# Altium schematic sheet PowerSupply.SchDoc
size A4
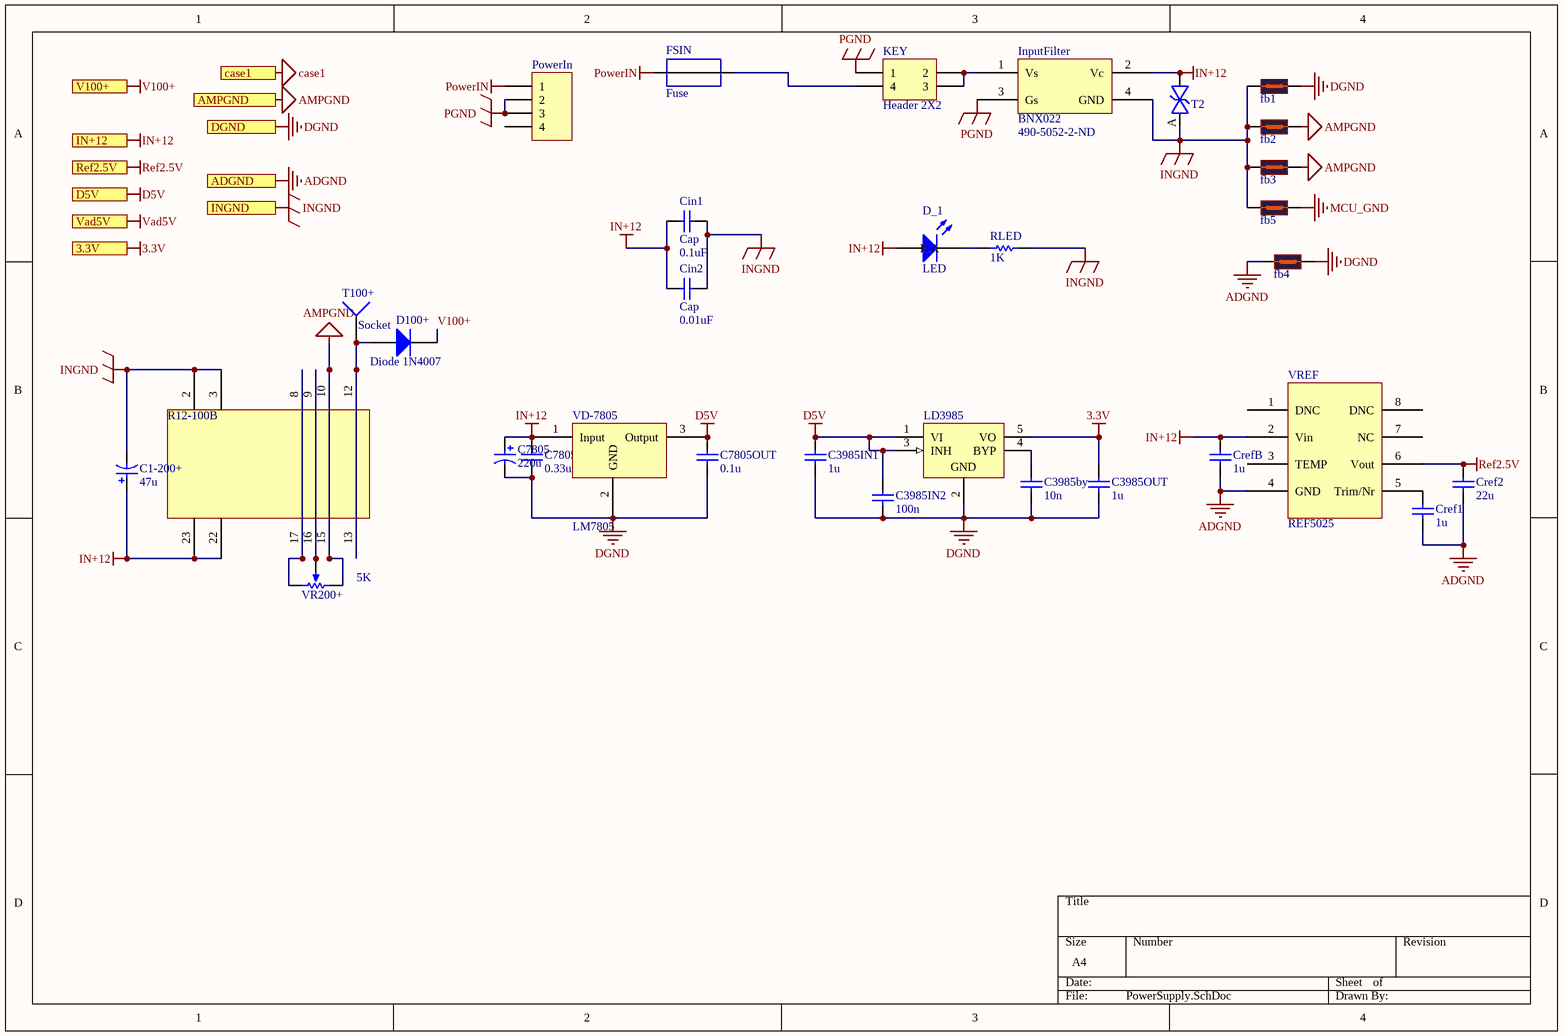
[diagram p0: PowerSupply.SchDoc]

## Parts
C1-200+  value 47u  [Cap_Rad2.5]  (hidden comment: ?)
C3985by  10n  [0805]
C3985IN1  1u  [0805]
C3985IN2  100n  [0805]
C3985OUT  1u  [0805]
C7805  value 220u  [Cap_Rad4mm]  (hidden comment: ?)
C7805IN  0.33u  [0805]
C7805OUT  0.1u  [0805]
Cin1  Cap  value 0.1uF  [0805]
Cin2  Cap  value 0.01uF  [0805]
Cref1  1u  [0805]
Cref2  22u  [0805]
CrefB  1u  [0805]
D100+  Diode 1N4007  [SMB]
D_1  LED  [LIGHT]
fb1  MH2029-300YCT-ND  [FB_0805]  (value not drawn)
fb2  MH2029-300YCT-ND  [FB_0805]  (value not drawn)
fb3  MH2029-300YCT-ND  [FB_0805]  (value not drawn)
fb4  MH2029-300YCT-ND  [FB_0805]  (value not drawn)
fb5  MH2029-300YCT-ND  [FB_0805]  (value not drawn)
FSIN  Fuse  [FuseHolder]
InputFilter  BNX022  Supplier Part Number 1: 490-5052-2-ND  [BNX022]
KEY  Header 2X2  [Power4Pin]
LD3985  LD3985G33R  [TSOT23-5L_N]  (value not drawn)
PowerIn  Header 4  [AC/DC3]  (value not drawn)
R12-100B  R12-150B  [R12-150B]  (value not drawn)
RLED  value 1K  [0805]  (hidden comment: ?)
T2  SMAJ150CA-E3/61GICT-ND  [DO-214AC]  (value not drawn)
T100+  Socket  [hole]
VD-7805  LM7805  [7805]
VR200+  value 5K  [VR]  (hidden comment: RPot)
VREF  REF5025  [SO8]

## Ports
3.3V, ADGND, AMPGND, case1, D5V, DGND, IN+12, INGND, Ref2.5V, V100+, Vad5V

## Nets
3.3V: C3985OUT.2 LD3985.5(VO) ; port 3.3V
ADGND: Cref1.1 Cref2.1 CrefB.1 fb4.1 VREF.4(GND) ; port ADGND
AMPGND: fb2.2 fb3.2 R12-100B.10 R12-100B.15 VR200+.1(TOP) ; port AMPGND
case1: port case1
D5V: C3985IN1.2 C3985IN2.2 C7805OUT.2 LD3985.1(VI) LD3985.3(INH) VD-7805.3(Output) ; port D5V
DGND: C3985by.1 C3985IN1.1 C3985IN2.1 C3985OUT.1 C7805.2(-) C7805IN.1 C7805OUT.1 fb1.2 fb4.2 LD3985.2(GND) VD-7805.2(GND) ; port DGND
IN+12: C1-200+.1(+) C7805.1(+) C7805IN.2 Cin1.1 Cin2.1 CrefB.2 D_1.A InputFilter.2(Vc) R12-100B.22 R12-100B.23 T2.K VD-7805.1(Input) VREF.2(Vin) ; port IN+12
INGND: C1-200+.2(-) Cin1.2 Cin2.2 fb1.1 fb2.1 fb3.1 fb5.1 InputFilter.4(GND) R12-100B.2 R12-100B.3 RLED.2 T2.A ; port INGND
MCU_GND: fb5.2
PGND: InputFilter.3(Gs) KEY.1 PowerIn.2 PowerIn.3
PowerIN: FSIN.1 PowerIn.1
Ref2.5V: Cref2.2 VREF.6(Vout) ; port Ref2.5V
V100+: D100+.2(K) ; port V100+
Vad5V: port Vad5V
NetC3985by_2: C3985by.2 LD3985.4(BYP)
NetCref1_2: Cref1.2 VREF.5(Trim/Nr)
NetD100+_1: D100+.1(A) R12-100B.12 R12-100B.13 T100+.1
NetD_1_K: D_1.K RLED.1
NetFSIN_2: FSIN.2 KEY.4
NetInputFilter_1: InputFilter.1(Vs) KEY.2 KEY.3
NetR12-100B_8: R12-100B.8 R12-100B.17 VR200+.2(BOT)
NetR12-100B_9: R12-100B.9 R12-100B.16 VR200+.3(TAP)

Not connected (* = marked no-connect by the designer): PowerIn 4; VREF 1(DNC) 3(TEMP) 7(NC) 8(DNC)

## Library data of the parts
C1-200+ C7805 = Cpol: Capacitor (Semiconductor SIM Model); PartNO: ?
C3985by C3985IN1 C3985IN2 C3985OUT C7805IN = Cap: Capacitor; Value: 0.33uF; Published: 8-Jun-2000; LatestRevisionDate: 17-Jul-2002; LatestRevisionNote: Re-released for DXP Platform.; PackageReference: RAD-0.3; Publisher: Altium Limited
C7805OUT = Cap: Capacitor; Value: 0.1uF; Published: 8-Jun-2000; LatestRevisionDate: 17-Jul-2002; LatestRevisionNote: Re-released for DXP Platform.; PackageReference: RAD-0.3; Publisher: Altium Limited
Cin1 Cin2 = Cap: Capacitor; Published: 8-Jun-2000; LatestRevisionDate: 17-Jul-2002; LatestRevisionNote: Re-released for DXP Platform.; PackageReference: RAD-0.3; Publisher: Altium Limited
Cref1 CrefB = Cap: Capacitor; Value: 1uF; Published: 8-Jun-2000; LatestRevisionDate: 17-Jul-2002; LatestRevisionNote: Re-released for DXP Platform.; PackageReference: RAD-0.3; Publisher: Altium Limited
Cref2 = Cap: Capacitor; Value: 22uF; Published: 8-Jun-2000; LatestRevisionDate: 17-Jul-2002; LatestRevisionNote: Re-released for DXP Platform.; PackageReference: RAD-0.3; Publisher: Altium Limited
D100+ = Diode 1N4007: 1 Amp General Purpose Rectifier; Published: 8-Jun-2000; LatestRevisionDate: 17-Jul-2002; LatestRevisionNote: Re-released for DXP Platform.; DatasheetVersion: 1998; PackageVersion: Aug-1999; PackageReference: DO-41; Publisher: Altium Limited; PackageDescription: Diode, Axial; Body 5.2 x 2.7 mm (LxDia. max), Lead Dia. 0.86 mm (max); Code_JEDEC: DO-204-AL; ComponentLink1Description: Manufacturer Link; ComponentLink1URL: http://www.fairchildsemi.com/; ComponentLink2Description: Datasheet; ComponentLink2URL: http://www.fairchildsemi.com/ds/1N%2F1N4001.pdf
D_1 = LED0: Typical INFRARED GaAs LED; Published: 8-Jun-2000; LatestRevisionDate: 08-Jul-2005; LatestRevisionNote: Mech Layer 1 removed.; PackageReference: LED-0; Publisher: Altium Limited
fb1-fb5 = FerriteBead: Ferrite bead; Value: 30; PartNO: MH2029-300YCT-ND
KEY = Header 2X2: Header, 2-Pin, Dual row; LatestRevisionDate: 17-Jul-2002; LatestRevisionNote: Re-released for DXP Platform.; Publisher: Altium Limited
LD3985 = LD3985G33R: 150mA, Ultra-Low Drop Low Noise BiCMOS Voltage Regulators Low ESR Capacitors Compatible, 3.3V, 5-Pin TSOT23-5L; DatasheetVersion: Jan-2011; PackageVersion: 2011; PackageReference: TSOT23-5L; PackageDescription: 5-Pin SOT-23 Package, 2.9 x 1.6 mm Body, 0.95 mm Pitch, 2.8 mm Lead Span; PartNumber: LD3985G33R; ComponentLink1Description: Manufacturer URL; ComponentLink1URL: http://www.st.com; ComponentLink2Description: Datasheet; ComponentLink2URL: http://www.st.com/internet/com/TECHNICAL_RESOURCES/TECHNICAL_LITERATURE/DATASHEET/CD00003395.pdf
PowerIn = Header 4: Header, 4-Pin; LatestRevisionDate: 17-Jul-2002; LatestRevisionNote: Re-released for DXP Platform.; Publisher: Altium Limited
RLED = Rsemi: Semiconductor Resistor, SMD; PartNO: ?
T2 = TVS_Bi: TVS, Bidirectional; PartNO: SMAJ150CA-E3/61GICT-ND
VR200+ = RPot: Potentiometer; Sim Note: Enter the Resistance value and the set point into parameter fields.; Set Position: 0.5; Published: 8-Jun-2000; LatestRevisionDate: 17-Jul-2002; LatestRevisionNote: Re-released for DXP Platform.; PackageReference: VR5; Publisher: Altium Limited
VREF = REF5050
FSIN = Fuse: PartNO: ?; value: ?
InputFilter = BNX022: Supplier 1: Digi-Key
T100+ = Socket: LatestRevisionDate: 17-Jul-2002; LatestRevisionNote: Re-released for DXP Platform.; Publisher: Altium Limited